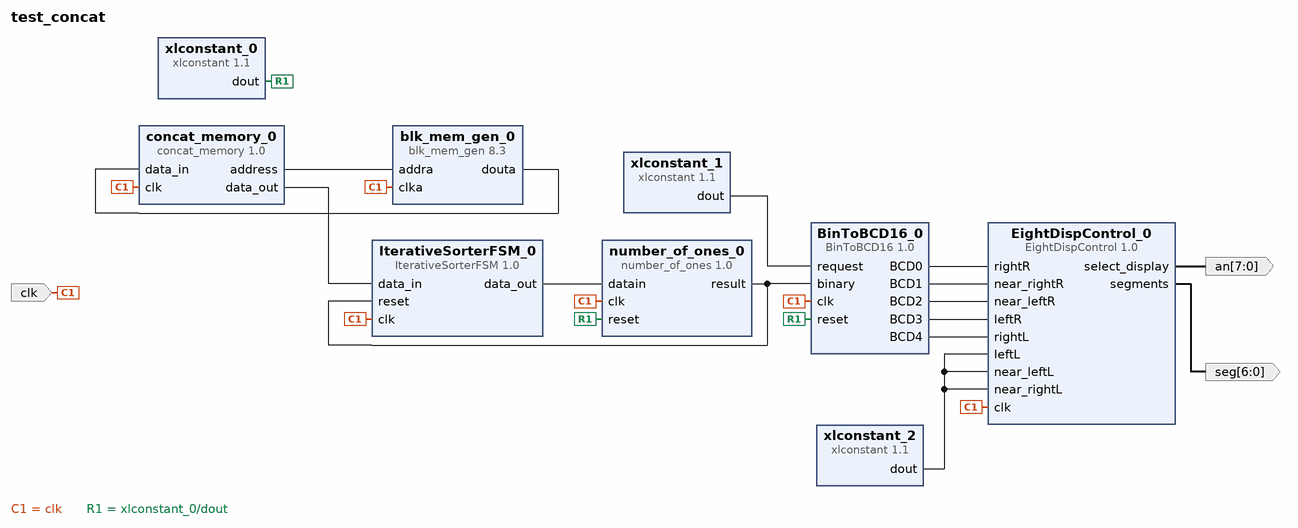
[diagram p0: block diagram of the top level]
# Vivado block design test_concat, xc7a100tcsg324-3, Vivado 2016.4
create_bd_design test_concat

create_bd_port -dir I clk
create_bd_port -dir O -from 7 -to 0 an
create_bd_port -dir O -from 6 -to 0 seg

create_bd_cell -type ip -vlnv xilinx.com:user:concat_memory:1.0 concat_memory_0
create_bd_cell -type ip -vlnv xilinx.com:ip:blk_mem_gen:8.3 blk_mem_gen_0
set_property -dict [list \
  CONFIG.Memory_Type Single_Port_ROM \
  CONFIG.Enable_32bit_Address false \
  CONFIG.Write_Width_A 16 \
  CONFIG.Enable_A Always_Enabled \
  CONFIG.Register_PortA_Output_of_Memory_Primitives true \
  CONFIG.Load_Init_File true \
  CONFIG.Coe_File ../../../../../../teste.coe \
  CONFIG.Use_RSTA_Pin false \
  CONFIG.Port_A_Write_Rate 0 \
  CONFIG.use_bram_block Stand_Alone \
] [get_bd_cells blk_mem_gen_0]
create_bd_cell -type ip -vlnv xilinx.com:user:number_of_ones:1.0 number_of_ones_0
set_property -dict {CONFIG.number_of_bits_input 2048 CONFIG.number_of_bits_output 16} [get_bd_cells number_of_ones_0]
create_bd_cell -type ip -vlnv xilinx.com:ip:xlconstant:1.1 xlconstant_0
set_property -dict {CONFIG.CONST_VAL 0} [get_bd_cells xlconstant_0]
create_bd_cell -type ip -vlnv xilinx.com:ip:xlconstant:1.1 xlconstant_1
create_bd_cell -type ip -vlnv ua.pt:user:EightDispControl:1.0 EightDispControl_0
create_bd_cell -type ip -vlnv xilinx.com:ip:xlconstant:1.1 xlconstant_2
set_property -dict {CONFIG.CONST_WIDTH 4 CONFIG.CONST_VAL 0} [get_bd_cells xlconstant_2]
create_bd_cell -type ip -vlnv xilinx.com:user:IterativeSorterFSM:1.0 IterativeSorterFSM_0
set_property -dict {CONFIG.L 16 CONFIG.M 128} [get_bd_cells IterativeSorterFSM_0]
create_bd_cell -type ip -vlnv ua.pt:user:BinToBCD16:1.0 BinToBCD16_0

# ---- connections ----

connect_bd_net [get_bd_ports clk] \
  [get_bd_pins concat_memory_0/clk] [get_bd_pins blk_mem_gen_0/clka] [get_bd_pins number_of_ones_0/clk] \
  [get_bd_pins EightDispControl_0/clk] [get_bd_pins IterativeSorterFSM_0/clk] [get_bd_pins BinToBCD16_0/clk]
connect_bd_net [get_bd_pins blk_mem_gen_0/douta] [get_bd_pins concat_memory_0/data_in]
connect_bd_net [get_bd_pins concat_memory_0/address] [get_bd_pins blk_mem_gen_0/addra]
connect_bd_net [get_bd_pins xlconstant_0/dout] [get_bd_pins number_of_ones_0/reset] [get_bd_pins BinToBCD16_0/reset]
connect_bd_net [get_bd_pins number_of_ones_0/result] [get_bd_pins IterativeSorterFSM_0/reset] [get_bd_pins BinToBCD16_0/binary]
connect_bd_net [get_bd_pins xlconstant_1/dout] [get_bd_pins BinToBCD16_0/request]
connect_bd_net [get_bd_pins BinToBCD16_0/BCD0] [get_bd_pins EightDispControl_0/rightR]
connect_bd_net [get_bd_pins BinToBCD16_0/BCD1] [get_bd_pins EightDispControl_0/near_rightR]
connect_bd_net [get_bd_pins BinToBCD16_0/BCD2] [get_bd_pins EightDispControl_0/near_leftR]
connect_bd_net [get_bd_pins BinToBCD16_0/BCD3] [get_bd_pins EightDispControl_0/leftR]
connect_bd_net [get_bd_pins BinToBCD16_0/BCD4] [get_bd_pins EightDispControl_0/rightL]
connect_bd_net [get_bd_pins xlconstant_2/dout] \
  [get_bd_pins EightDispControl_0/leftL] [get_bd_pins EightDispControl_0/near_leftL] \
  [get_bd_pins EightDispControl_0/near_rightL]
connect_bd_net [get_bd_pins EightDispControl_0/select_display] [get_bd_ports an]
connect_bd_net [get_bd_pins EightDispControl_0/segments] [get_bd_ports seg]
connect_bd_net [get_bd_pins concat_memory_0/data_out] [get_bd_pins IterativeSorterFSM_0/data_in]
connect_bd_net [get_bd_pins IterativeSorterFSM_0/data_out] [get_bd_pins number_of_ones_0/datain]

validate_bd_design
save_bd_design
